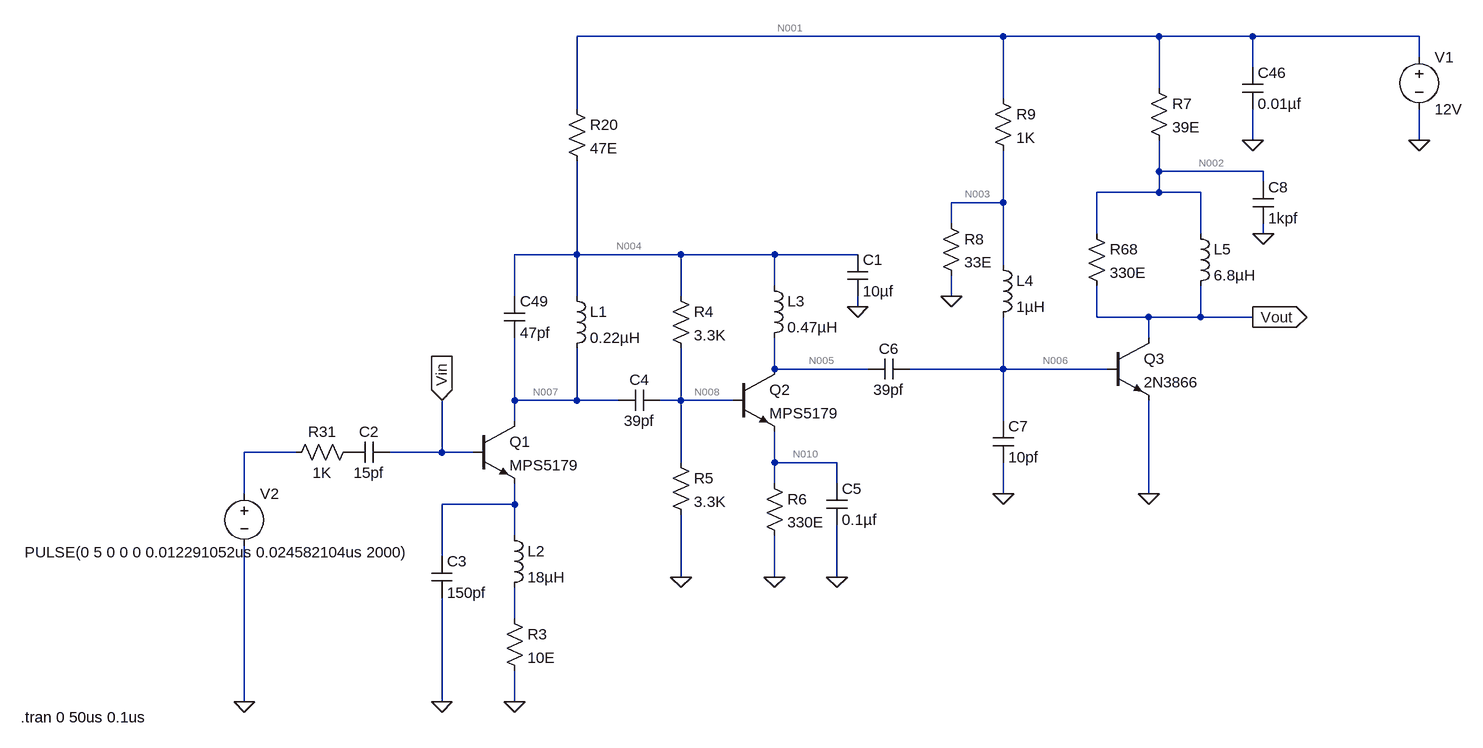
[diagram p0: schematic MPS5179_2N3866_Cascaded.asc]
MPS5179_2N3866_Cascaded.asc, the LTspice schematic file:
Version 4
SHEET 1 1836 680
WIRE 960 -496 304 -496
WIRE 1200 -496 960 -496
WIRE 1344 -496 1200 -496
WIRE 1600 -496 1344 -496
WIRE 1600 -464 1600 -496
WIRE 1344 -448 1344 -496
WIRE 1200 -416 1200 -496
WIRE 960 -400 960 -496
WIRE 304 -384 304 -496
WIRE 1344 -336 1344 -384
WIRE 1600 -336 1600 -384
WIRE 1200 -288 1200 -336
WIRE 1360 -288 1200 -288
WIRE 1360 -272 1360 -288
WIRE 1200 -256 1200 -288
WIRE 1200 -256 1104 -256
WIRE 1264 -256 1200 -256
WIRE 960 -240 960 -320
WIRE 960 -240 880 -240
WIRE 880 -208 880 -240
WIRE 1104 -192 1104 -256
WIRE 1264 -192 1264 -256
WIRE 1360 -192 1360 -208
WIRE 304 -160 304 -304
WIRE 304 -160 208 -160
WIRE 464 -160 304 -160
WIRE 608 -160 464 -160
WIRE 736 -160 608 -160
WIRE 960 -144 960 -240
WIRE 608 -112 608 -160
WIRE 208 -96 208 -160
WIRE 304 -96 304 -160
WIRE 464 -96 464 -160
WIRE 880 -96 880 -128
WIRE 736 -80 736 -96
WIRE 1104 -64 1104 -112
WIRE 1184 -64 1104 -64
WIRE 1264 -64 1264 -112
WIRE 1264 -64 1184 -64
WIRE 1344 -64 1264 -64
WIRE 1184 -32 1184 -64
WIRE 608 16 608 -32
WIRE 752 16 608 16
WIRE 960 16 960 -64
WIRE 960 16 816 16
WIRE 1120 16 960 16
WIRE 208 64 208 -32
WIRE 304 64 304 -16
WIRE 304 64 208 64
WIRE 368 64 304 64
WIRE 464 64 464 -16
WIRE 464 64 432 64
WIRE 544 64 464 64
WIRE 208 96 208 64
WIRE 960 96 960 16
WIRE -128 144 -208 144
WIRE 96 144 96 64
WIRE 96 144 16 144
WIRE 144 144 96 144
WIRE 464 160 464 64
WIRE 608 160 608 112
WIRE 704 160 608 160
WIRE 608 192 608 160
WIRE 704 192 704 160
WIRE -208 208 -208 144
WIRE 960 208 960 160
WIRE 1184 208 1184 64
WIRE 208 224 208 192
WIRE 208 224 96 224
WIRE 208 272 208 224
WIRE 96 304 96 224
WIRE 464 336 464 240
WIRE 608 336 608 272
WIRE 704 336 704 256
WIRE 208 400 208 352
WIRE -208 528 -208 288
WIRE 96 528 96 368
WIRE 208 528 208 480
FLAG 1600 -336 0
FLAG 96 528 0
FLAG 208 528 0
FLAG -208 528 0
FLAG 464 336 0
FLAG 608 336 0
FLAG 704 336 0
FLAG 736 -80 0
FLAG 960 208 0
FLAG 880 -96 0
FLAG 1184 208 0
FLAG 1344 -336 0
FLAG 1360 -192 0
FLAG 96 64 Vin
IOPIN 96 64 In
FLAG 1344 -64 Vout
IOPIN 1344 -64 Out
SYMBOL cap 192 -96 R0
SYMATTR InstName C49
SYMATTR Value 47pf
SYMBOL ind 288 -112 R0
SYMATTR InstName L1
SYMATTR Value 0.22µH
SYMBOL cap 80 304 R0
SYMATTR InstName C3
SYMATTR Value 150pf
SYMBOL ind 192 256 R0
SYMATTR InstName L2
SYMATTR Value 18µH
SYMBOL res 192 384 R0
SYMATTR InstName R3
SYMATTR Value 10E
SYMBOL res 288 -400 R0
SYMATTR InstName R20
SYMATTR Value 47E
SYMBOL voltage 1600 -480 R0
SYMATTR InstName V1
SYMATTR Value 12V
SYMBOL cap 16 128 R90
WINDOW 0 0 32 VBottom 2
WINDOW 3 32 32 VTop 2
SYMATTR InstName C2
SYMATTR Value 15pf
SYMBOL res -32 128 R90
WINDOW 0 0 56 VBottom 2
WINDOW 3 32 56 VTop 2
SYMATTR InstName R31
SYMATTR Value 1K
SYMBOL voltage -208 192 R0
WINDOW 3 -338 106 Left 2
SYMATTR Value PULSE(0 5 0 0 0 0.012291052us 0.024582104us 2000)
SYMATTR InstName V2
SYMBOL npn 144 96 R0
SYMATTR InstName Q1
SYMATTR Value MPS5179
SYMBOL npn 544 16 R0
SYMATTR InstName Q2
SYMATTR Value MPS5179
SYMBOL cap 432 48 R90
WINDOW 0 0 32 VBottom 2
WINDOW 3 32 32 VTop 2
SYMATTR InstName C4
SYMATTR Value 39pf
SYMBOL res 448 -112 R0
SYMATTR InstName R4
SYMATTR Value 3.3K
SYMBOL res 448 144 R0
SYMATTR InstName R5
SYMATTR Value 3.3K
SYMBOL res 592 176 R0
SYMATTR InstName R6
SYMATTR Value 330E
SYMBOL cap 688 192 R0
SYMATTR InstName C5
SYMATTR Value 0.1µf
SYMBOL ind 592 -128 R0
SYMATTR InstName L3
SYMATTR Value 0.47µH
SYMBOL cap 720 -160 R0
SYMATTR InstName C1
SYMATTR Value 10µf
SYMBOL npn 1120 -32 R0
SYMATTR InstName Q3
SYMATTR Value 2N3866
SYMBOL cap 816 0 R90
WINDOW 0 0 32 VBottom 2
WINDOW 3 32 32 VTop 2
SYMATTR InstName C6
SYMATTR Value 39pf
SYMBOL ind 944 -160 R0
SYMATTR InstName L4
SYMATTR Value 1µH
SYMBOL res 864 -224 R0
SYMATTR InstName R8
SYMATTR Value 33E
SYMBOL res 944 -416 R0
SYMATTR InstName R9
SYMATTR Value 1K
SYMBOL cap 944 96 R0
SYMATTR InstName C7
SYMATTR Value 10pf
SYMBOL res 1088 -208 R0
SYMATTR InstName R68
SYMATTR Value 330E
SYMBOL ind 1248 -208 R0
SYMATTR InstName L5
SYMATTR Value 6.8µH
SYMBOL res 1184 -432 R0
SYMATTR InstName R7
SYMATTR Value 39E
SYMBOL cap 1328 -448 R0
SYMATTR InstName C46
SYMATTR Value 0.01µf
SYMBOL cap 1344 -272 R0
SYMATTR InstName C8
SYMATTR Value 1kpf
TEXT -552 552 Left 2 !.tran 0 50us 0.1us

The netlist it stands for:
* MPS5179_2N3866_Cascaded.asc
C49 N004 N007 47pf
L1 N004 N007 0.22µH
C3 N011 0 150pf
L2 N011 N012 18µH
R3 N012 0 10E
R20 N001 N004 47E
V1 N001 0 12V
C2 Vin P001 15pf
R31 P001 N009 1K
V2 N009 0 PULSE(0 5 0 0 0 0.012291052us 0.024582104us 2000)
Q1 N007 Vin N011 0 MPS5179
Q2 N005 N008 N010 0 MPS5179
C4 N008 N007 39pf
R4 N004 N008 3.3K
R5 N008 0 3.3K
R6 N010 0 330E
C5 N010 0 0.1µf
L3 N004 N005 0.47µH
C1 N004 0 10µf
Q3 Vout N006 0 0 2N3866
C6 N006 N005 39pf
L4 N003 N006 1µH
R8 N003 0 33E
R9 N001 N003 1K
C7 N006 0 10pf
R68 N002 Vout 330E
L5 N002 Vout 6.8µH
R7 N001 N002 39E
C46 N001 0 0.01µf
C8 N002 0 1kpf
.model NPN NPN
.model PNP PNP
.lib standard.bjt
.tran 0 50us 0.1us
.backanno
.end

* Results of the author's LTspice run, read from the files saved beside the schematic
* Operating Point, zero values left out:
*   V(n004) = 11.27 V
*   V(n007) = 11.27 V
*   V(n001) = 12 V
*   V(vin) = 329.3 mV
*   V(n005) = 11.27 V
*   V(n008) = 5.378 V
*   V(n010) = 4.561 V
*   V(vout) = 12 V
*   V(n006) = 383.2 mV
*   V(n003) = 383.2 mV
*   V(n002) = 12 V
*   Ic(Q3) = 39.97 µA
*   Ib(Q3) = 4.016 µA
*   Ie(Q3) = -43.98 µA
*   Ic(Q2) = 13.66 mA
*   Ib(Q2) = 156.7 µA
*   Ie(Q2) = -13.82 mA
*   Ic(Q1) = 242 pA
*   Ie(Q1) = -242 pA
*   I(C8) = 12 nA
*   I(L5) = 39.97 µA
*   I(L4) = 4.016 µA
*   I(L3) = 13.66 mA
*   I(L2) = 242 pA
*   I(L1) = 241.6 pA
*   I(R7) = 39.98 µA
*   I(R68) = 121.1 pA
*   I(R9) = 11.62 mA
*   I(R8) = 11.61 mA
*   I(R6) = 13.82 mA
*   I(R5) = 1.63 mA
*   I(R4) = 1.786 mA
*   I(R20) = 15.45 mA
*   I(R3) = 242 pA
*   I(V1) = -27.11 mA